# EasyEDA Pro project ByByte_nano.epro, board LIneTracker_PCB
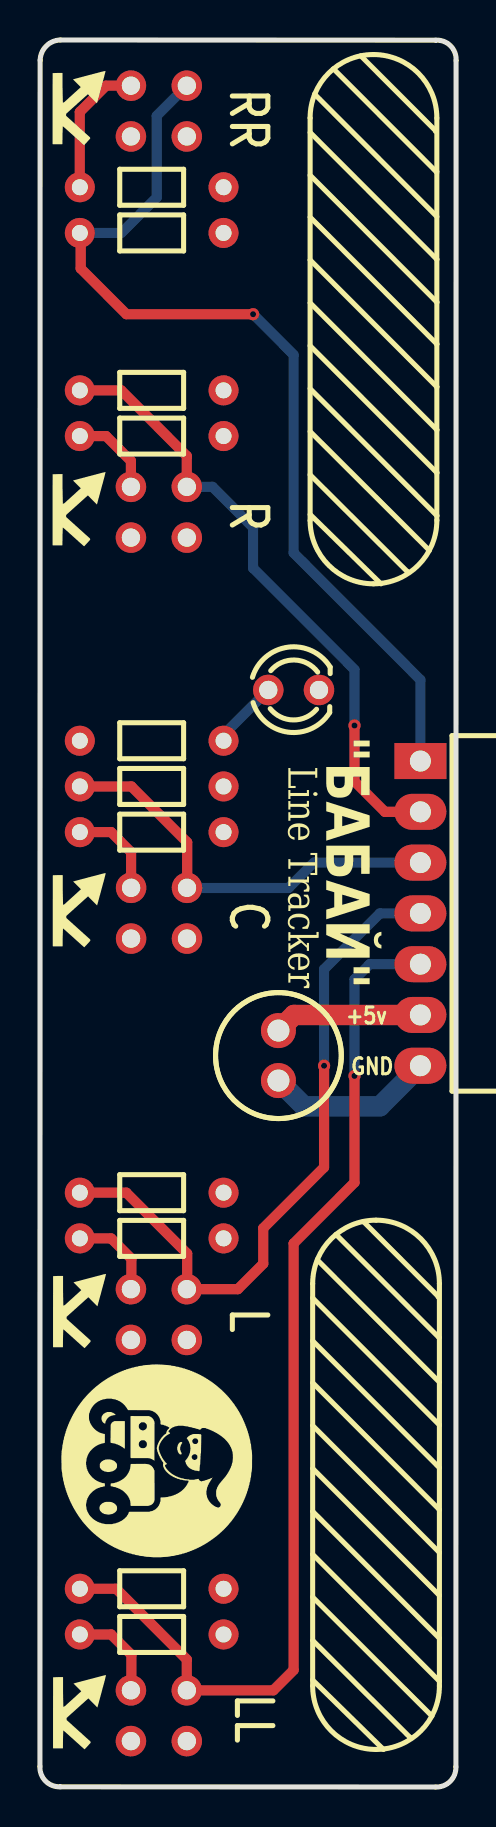
[diagram p4: board, top side]
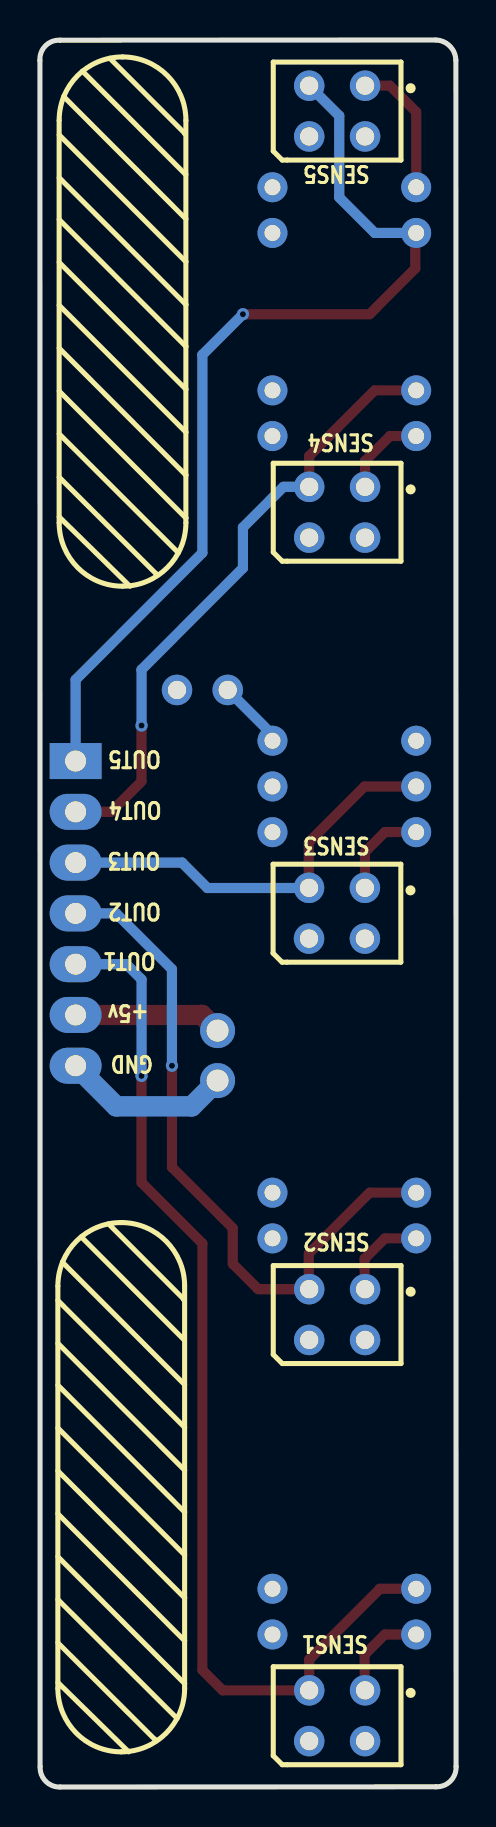
[diagram p5: board, bottom side, seen from below]

Outline 20.85 x 87.39 mm; copper layers: Top Layer, Bottom Layer. Coordinates in mm from the lower left corner of the outline.
Outline path: 0.01,86.37 0,1.03 arc(0.28,0.3) 1.02,0.01 19.82,0 arc(20.55,0.28) 20.84,1.02 20.85,86.36 arc(20.57,87.1) 19.83,87.38 1.03,87.39 arc(0.31,87.08) 0.01,86.37
Stack: Top Layer 0.035mm / Dielectric1 1.51mm FR4 er 4.5 / Bottom Layer 0.035mm

## Design rules (mm)
template: JLCPCB Capability(Two Layers Board)
spacing copperThickness1oz (default): track to track 0.102, other pairs 0.152 to 0.3
spacing copperThickness2oz: track to track 0.203, other pairs 0.152 to 0.3
track width copperThickness1oz (default): min 0.127, default 0.254, max 2.54
track width copperThickness2oz: min 0.203, default 0.254, max 2.54
differential pair differentialPair (default): width min 0.127, default 0.254, max 2.54; gap min 0.152, default 0.152
via viaSize (default): diameter min 0.5, default 0.61, max 10; hole min 0.3, default 0.305, max 6.3

## Placement (name value [footprint] x y rotation side)
C1  100uF  [CAP-TH_BD6.3-P2.5-D0.6-FD-RYHG35V100UF]  11.95 36.59 270 top
H1  KH-2.54PH90-1X7P-L13.8  [HDR-TH_7P-P2.54-H-M-W10.4-N]  19.06 43.7 270 top
LED1  -  [LED-TH_BD3.0-P2.54-FD]  12.71 54.87 0 top
R1  1k  [RES-TH_BD1.8-L3.2-P7.20-D0.4]  5.6 80.02 180 top
R2  1k  [RES-TH_BD1.8-L3.2-P7.20-D0.4]  5.6 67.57 180 top
R3  1k  [RES-TH_BD1.8-L3.2-P7.20-D0.4]  5.6 47.76 180 top
R4  1k  [RES-TH_BD1.8-L3.2-P7.20-D0.4]  5.6 27.44 180 top
R5  1k  [RES-TH_BD1.8-L3.2-P7.20-D0.4]  5.6 7.63 180 top
R6  10k  [RES-TH_BD1.8-L3.2-P7.20-D0.4]  5.6 77.73 0 top
R7  10k  [RES-TH_BD1.8-L3.2-P7.20-D0.4]  5.6 69.86 0 top
R8  10k  [RES-TH_BD1.8-L3.2-P7.20-D0.4]  5.6 50.05 0 top
R9  10k  [RES-TH_BD1.8-L3.2-P7.20-D0.4]  5.6 29.73 0 top
R10  10k  [RES-TH_BD1.8-L3.2-P7.20-D0.4]  5.6 9.92 0 top
R11  1k  [RES-TH_BD1.8-L3.2-P7.20-D0.4]  5.6 52.33 180 top
U1  DY-ITR20001  [OPTO-TH_DY-ITR20001]  5.96 83.83 0 bottom
U2  DY-ITR20001  [OPTO-TH_DY-ITR20001]  5.96 63.76 0 bottom
U3  DY-ITR20001  [OPTO-TH_DY-ITR20001]  5.97 43.71 0 bottom
U4  DY-ITR20001  [OPTO-TH_DY-ITR20001]  5.96 23.63 0 bottom
U5  DY-ITR20001  [OPTO-TH_DY-ITR20001]  5.96 3.57 0 bottom

## Footprints (pads in the part's own frame, mm; a bottom-side part is the same pattern mirrored in y, then rotated)
CAP-TH_BD6.3-P2.5-D0.6-FD-RYHG35V100UF
  round 1.75 hole 1.1: 1(-1.25,0) 2(1.25,0)
HDR-TH_7P-P2.54-H-M-W10.4-N
  rect 1.8x2.6 hole 1.05: 1(-7.62,0)
  oval 1.8x2.6 hole 1.05: 2(-5.08,0) 3(-2.54,0) 4(0,0) 5(2.54,0) 6(5.08,0) 7(7.62,0)
LED-TH_BD3.0-P2.54-FD
  round 1.524 hole 0.914: 1(-1.27,0) 2(1.27,0)
OPTO-TH_DY-ITR20001
  round 1.524 hole 0.914: 1(-1.4,-1.27) 2(-1.4,1.27) 3(1.4,1.27) 4(1.4,-1.27)
RES-TH_BD1.8-L3.2-P7.20-D0.4
  round 1.5 hole 0.8: 1(-3.6,0) 2(3.6,0)

## Nets
As in the schematic.

## Via types
v1: diameter 0.61, hole 0.305, Top Layer to Bottom Layer, 4 vias

## Routing (per net, layer and track width the routed paths; a pad name or vN(x,y) marks a point on that pad's centre or on a via; arc(x,y) is an arc through that point)
+5V: length 7.4
  Top Layer w1.016: H1.6 12.73,38.62 C1.1
GND: length 8.5
  Bottom Layer w1.016: C1.2 13.24,34.05 17.03,34.05 H1.7
$1N740: length 6.9
  Top Layer w0.508: U1.1 3.31,85.1 2,83.79 R1.2
$1N745: length 4.4
  Top Layer w0.508: U2.1 4.56,66.33 3.31,67.57 R2.2
$1N750: length 4.8
  Top Layer w0.508: U3.1 4.57,46.76 3.57,47.76 R3.2
$1N755: length 4.5
  Top Layer w0.508: U4.1 4.58,24.93 4.58,26.43 3.57,27.44 R4.2
$1N760: length 4.8
  Top Layer w0.508: U5.1 4.58,4.86 4.58,6.61 3.57,7.63 R5.2
$1N967: length 48
  Top Layer w0.508: R6.1 2.04,77.69 2.04,75.96 4.33,73.67 v1(10.68,73.67)
  Bottom Layer w0.508: R6.1 4.07,77.73 5.85,79.51 5.85,83.59 U1.4 ; H1.1 19.06,55.38 12.71,61.73 12.71,71.64 v1(10.68,73.67)
$1N973: length 31.2
  Top Layer w0.508: v1(15.76,53.1) 15.76,50.3 17.28,48.78 H1.2 ; U2.4 7.36,66.58 4.07,69.86 R7.1
  Bottom Layer w0.508: v1(15.76,53.1) 15.76,55.89 10.68,60.97 10.68,63 8.65,65.03 U2.4
$1N979: length 21
  Top Layer w0.508: R8.1 4.58,50.05 7.38,47.25 7.38,44.99 U3.4
  Bottom Layer w0.508: H1.3 13.73,46.24 12.46,44.97 7.38,44.97 U3.4
$1N985: length 34.8
  Top Layer w0.508: v1(14.23,36.08) 14.23,31 11.19,27.95 11.19,26.17 9.92,24.9 U4.4 7.38,24.92 7.38,26.68 4.33,29.73 R9.1
  Bottom Layer w0.508: v1(14.23,36.08) 14.23,40.9 17.03,43.7 H1.4
$1N991: length 53.6
  Top Layer w0.508: R10.1 3.82,9.92 7.36,6.38 U5.4 11.69,4.84 12.71,5.85 12.71,27.19 15.76,30.24 v1(15.76,35.57)
  Bottom Layer w0.508: H1.5 16.52,41.16 15.76,40.4 v1(15.76,35.57)
$1N1528: length 3.5
  Bottom Layer w0.508: R11.1 9.2,52.63 LED1.1

## Copper pours and planes (outline as drawn; the poured copper is in the pictures)
+5V on Bottom Layer: 0.01,87.64 20.84,87.64 20.84,-0.24 0.01,-0.24
GND on Top Layer: 0.02,87.64 20.84,87.64 20.84,-0.24 0.02,-0.24

## Text on the board
Bottom Silkscreen Layer: SENS4 | SENS5 | SENS3 | SENS2 | SENS1 | OUT4 | OUT5 | OUT2 | OUT3 | OUT1 | GND | +5v
Top Silkscreen Layer: +5v | GND | RR | R | C | L | LL | Line Tracker | "БАБАЙ"
